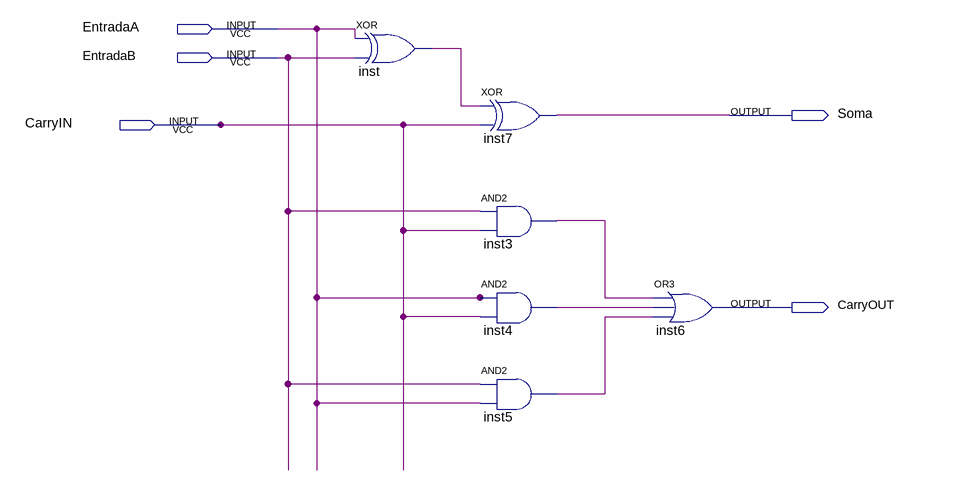
[diagram p0: schematic sheet]
// Quartus schematic SomaSerieSD.bdf as structural Verilog: 6 symbols, 5 pins
module SomaSerieSD (
  input  EntradaA,
  input  EntradaB,
  input  CarryIN,
  output Soma,
  output CarryOUT
);

  wire inst3_out, inst4_out, inst5_out, inst_out;

  xor inst (inst_out, EntradaA, EntradaB);
  xor inst7 (Soma, inst_out, CarryIN);
  and inst3 (inst3_out, EntradaB, CarryIN);
  and inst4 (inst4_out, EntradaA, CarryIN);
  and inst5 (inst5_out, EntradaB, EntradaA);
  or inst6 (CarryOUT, inst3_out, inst4_out, inst5_out);
endmodule
